# EAGLE design usb-pickit2-adapter (EAGLE 7.5.0)
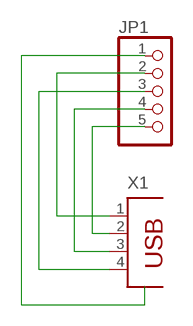
[diagram p0: schematic, sheet 1]

## Parts
JP1  PINHD-1X5  [1X05]
X1  PN87520  [PN87520]

## Nets
N$1: JP1.2 X1.1
N$2: JP1.3 X1.4
N$4: JP1.5 X1.2
N$5: JP1.4 X1.3
N$6: JP1.1

## Library data of the parts
JP1 = pinhead:PINHD-1X5: PIN HEADER
X1 = con-berg:PN87520: BERG USB connector; OC_FARNELL: unknown; OC_NEWARK: unknown

## Board
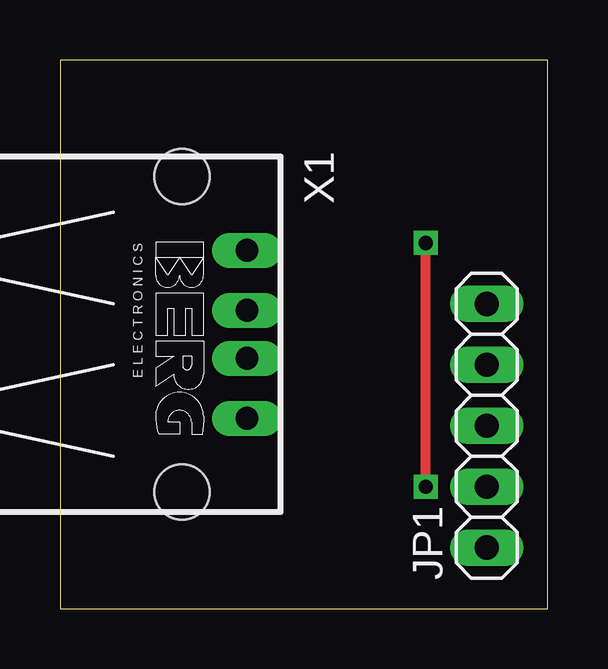
[diagram p1: board, top side]
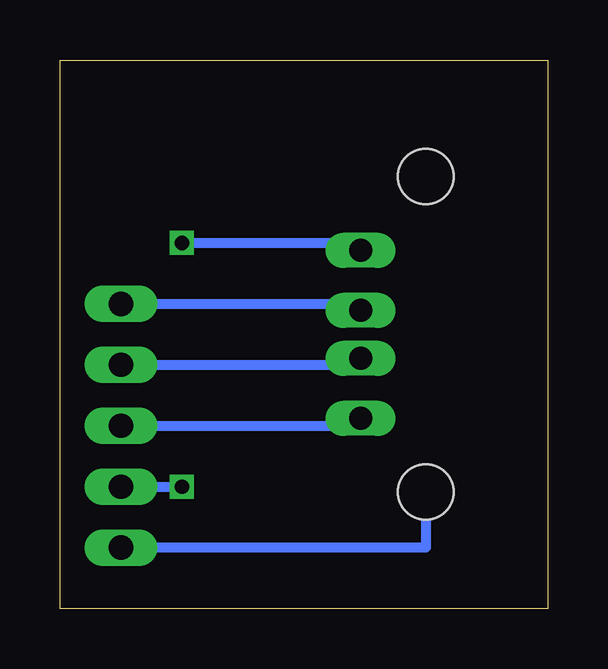
[diagram p2: board, bottom side, seen from below]

Size 20.32 x 22.86 mm. Coordinates in mm from the lower left corner, seen from the top.
Outline: 0,0 20.32,0 20.32,22.86 0,22.86 0,0
Copper layers (1*16): Top 0.035mm / dielectric 1.5mm / Bottom 0.035mm
Design rules "default": minimum track width 10mil, minimum drill 24mil, track to track 8mil, track to pad 8mil, pad to pad 8mil, via to via 8mil, smd to smd 8mil, copper to edge 40mil, drill to drill 8mil, minimum pad ring 10mil, minimum via ring 8mil, stop-mask expansion 4mil, vias tented up to drill 0mil, thermal gap 10mil

### Footprints (pad centres in the part's own frame; a part is rotated, then mirrored left to right if it is on the bottom)
1X05 = drill 1.016 long: 1 -5.08,0; 2 -2.54,0; 3 0,0; 4 2.54,0; 5 5.08,0
PN87520 = drill 0.95 long: 1 -3.5,2.71; 2 -1,2.71; 3 1,2.71; 4 3.5,2.71 | hole 2.3: -6.57,0; 6.57,0

### Placement (x,y rotation side)
JP1  17.78,7.62 90 top
X1  5.08,11.43 270 top

### Tracks (layer width: path | path; a pad name or v marks a point on that pad's centre or on a via)
N$1  (via drill 0.6)
  Top 0.406: v15.24,5.08 v15.24,15.24
  Bottom 0.406: JP1.2 v15.24,5.08 | v15.24,15.24 7.79,15.24 X1.1
N$2
  Bottom 0.406: JP1.3 7.79,7.62 | 7.62,7.62 7.79,7.62 | 7.79,7.62 X1.4
N$4
  Bottom 0.406: JP1.5 7.79,12.7 X1.2
N$5
  Bottom 0.406: JP1.4 7.79,10.16 X1.3
N$6
  Bottom 0.406: 5.08,5.08 5.08,2.54 JP1.1